# EAGLE design power_up_v2 (EAGLE 9.6.2)
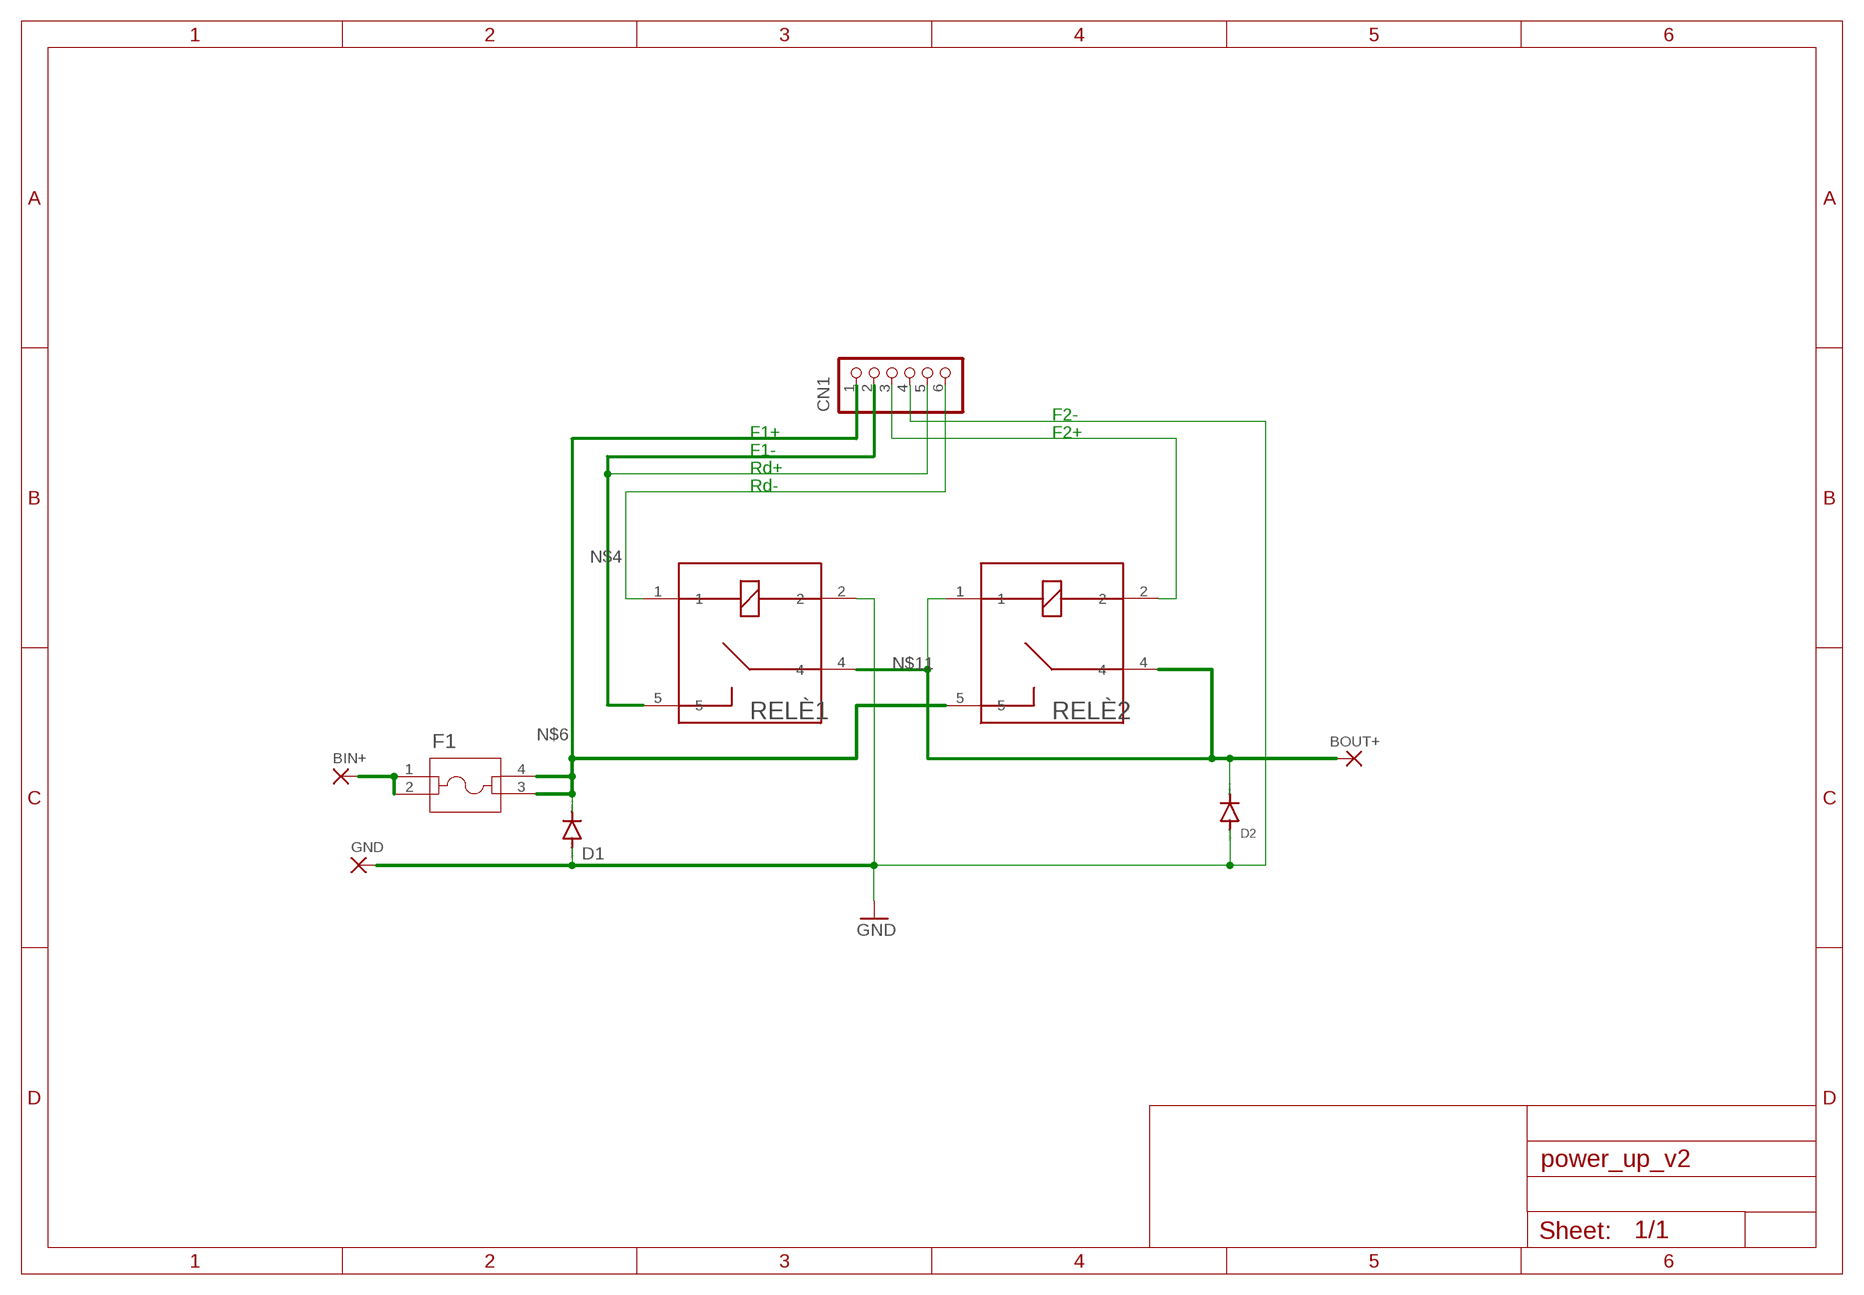
[diagram p0: schematic, sheet 1]

## Parts
BIN+  WIREPAD3,81/1,4  [12/0,7]
BOUT+  WIREPAD3,81/1,4  [12/0,7]
CN1  B6P-VH  [B6P-VH]
D1  BY550  [DO27-15]
D2  BY550  [DO27-15]
F1  3568  [3568_KEY]
GND  WIREPAD3,81/1,4  [12/0,7]
RELÈ1  1393280-5  [RELAY_1393280-5]
RELÈ2  1393280-5  [RELAY_1393280-5]

## Nets
GND: CN1.4 D1.A D2.A GND.1(P) RELÈ1.2
N$2: BIN+.1(P) F1.1 F1.2
N$4: CN1.2 CN1.5 RELÈ1.5
N$5: CN1.3 RELÈ2.2
N$6: CN1.1 D1.C F1.3 F1.4 RELÈ2.5
N$9: CN1.6 RELÈ1.1
N$11: BOUT+.1(P) D2.C RELÈ1.4 RELÈ2.1 RELÈ2.4

## Notes on the sheet
- F2-
- F1+ | F2+
- F1-
- Rd+
- Rd-

## Library data of the parts
BIN+ BOUT+ GND = wirepad:WIREPAD: Wire PAD connect wire on PCB
CN1 = jst-vh:B6P-VH: Wire-to-Board 3.96mm pitch top mount connector Source: http://www.jst-mfg.com/product/pdf/jpn/VH.pdf http://www.jst-mfg.com/product/detail.php?series=262
D1 D2 = diode:BY550: DIODE Si200 V, 5 A
F1 = 3568:3568; COPYRIGHT: Copyright (C) 2024 Ultra Librarian. All rights reserved.; MANUFACTURER_PART_NUMBER: 3568; MFR_NAME: Keystone Electronics
RELÈ1 RELÈ2 = 1393280-5:1393280-5; MANUFACTURER: TE Connectivity; MAXIMUM_PACKAGE_HEIGHT: 1.1 mm; PARTREV: 2102; STANDARD: Manufacturer Recommendations

## Board
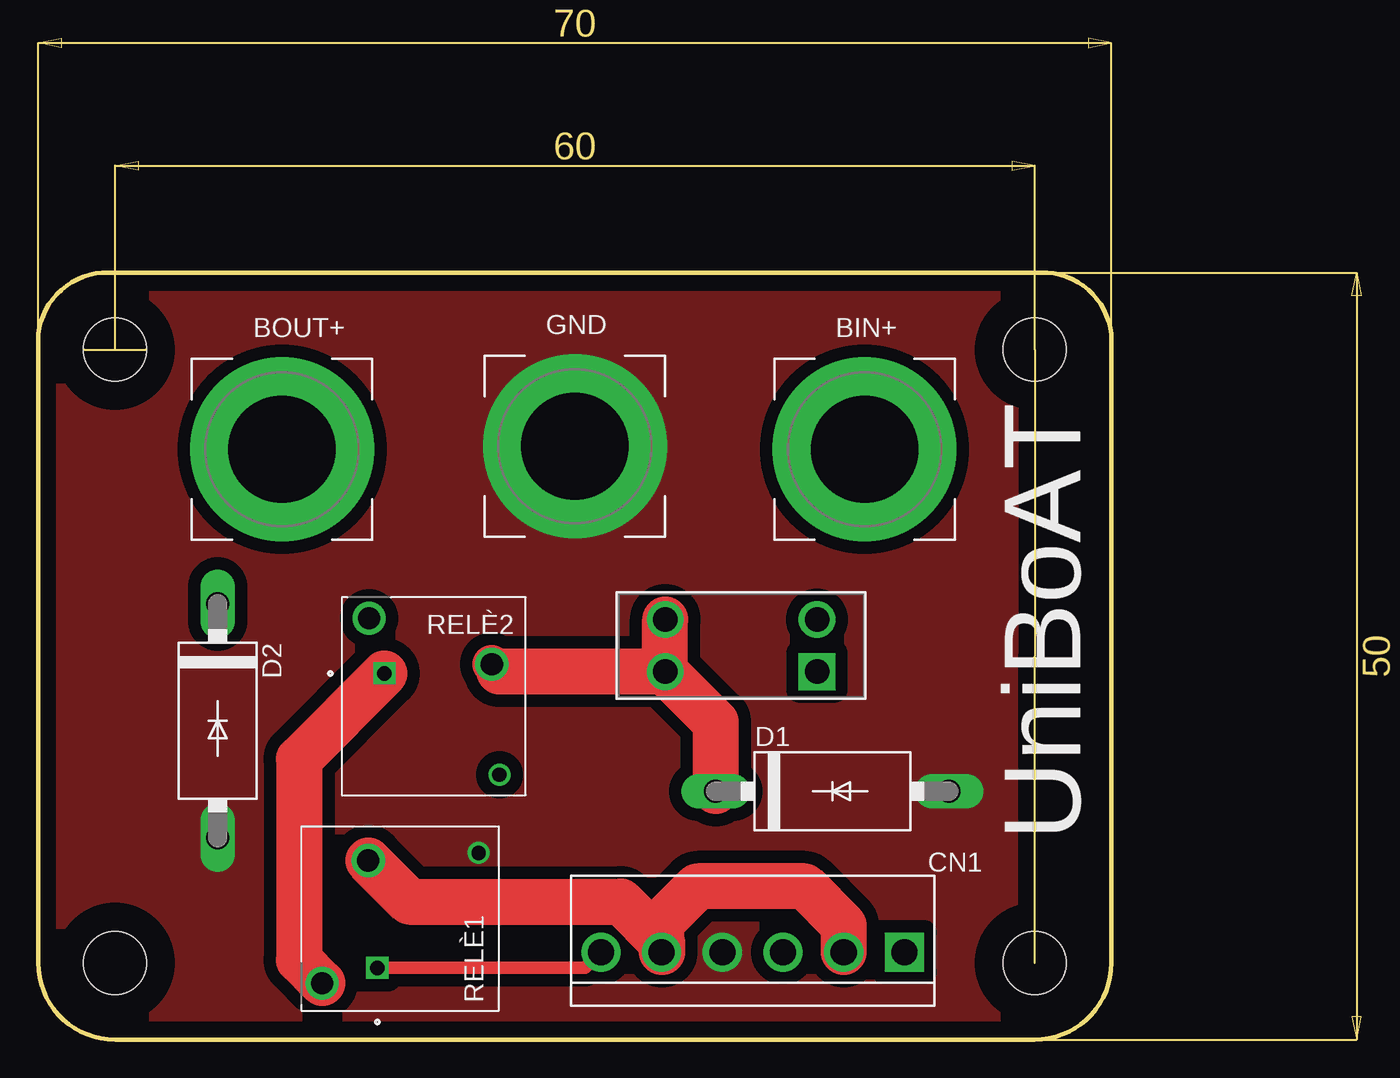
[diagram p1: board, top side]
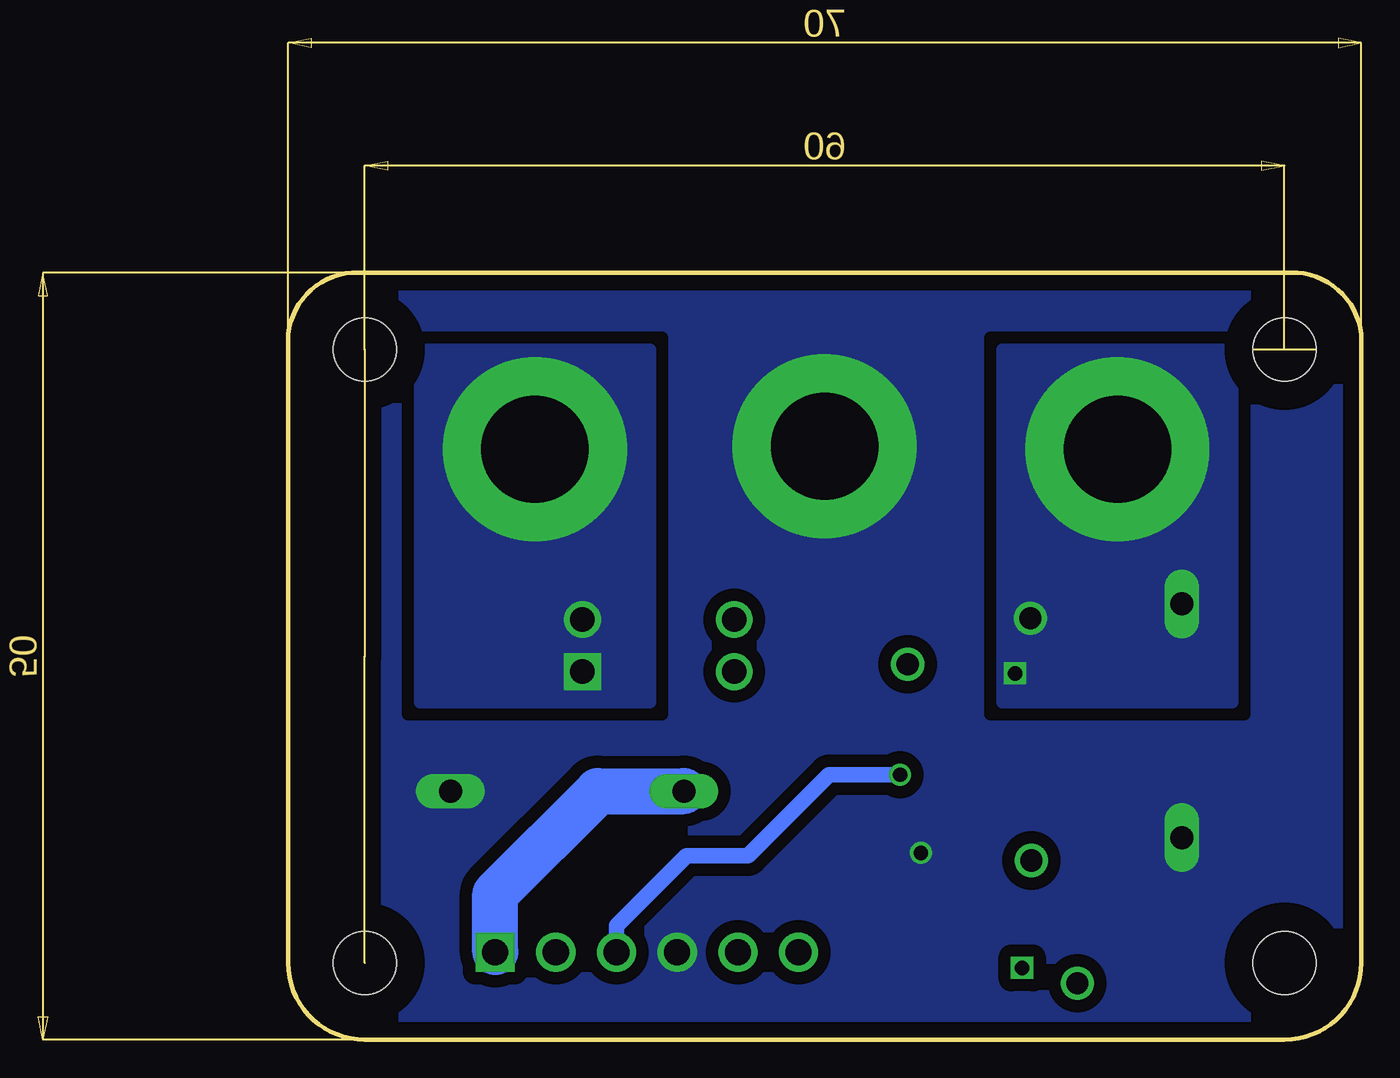
[diagram p2: board, bottom side, seen from below]

Size 70 x 50.03 mm. Coordinates in mm from the lower left corner, seen from the top.
Outline: 0,5 0,46 arc-90 5,50 65,50 arc-90 70,46 70,5 arc-90 65,0 5,0 arc-90 0,5
Copper layers (1*16): Top 0.035mm / dielectric 1.5mm / Bottom 0.035mm
Design rules "default *": minimum track width 6mil, minimum drill 0.35mm, track to track 8mil, track to pad 6mil, pad to pad 6mil, via to via 6mil, smd to smd 6mil, copper to edge 40mil, drill to drill 6mil, minimum pad ring 10mil, minimum via ring 8mil, stop-mask expansion 4mil, vias tented up to drill 0mil, thermal gap 10mil

### Footprints (pad centres in the part's own frame; a part is rotated, then mirrored left to right if it is on the bottom)
12/0,7 = drill 7 pad 12: 1 0,0
B6P-VH = drill 1.7 square: 1 -9.9,0 | drill 1.7: 2 -5.94,0; 3 -1.98,0; 4 1.98,0; 5 5.94,0; 6 9.9,0
DO27-15 = drill 1.499 long: A 7.62,0; C -7.62,0
3568_KEY = drill 1.6 pad 2.108 square: 1 0,0 | drill 1.6 pad 2.108: 2 0,-3.404; 3 9.906,-3.404; 4 9.906,0
RELAY_1393280-5 = drill 0.93 square: 1 3.22,-1.48 | drill 0.93: 2 -4.28,5.12 | drill 1.45: 4 4.22,-5.08; 5 -3.78,-2.08
M4_HOLE = hole 4.1: 0,0

### Placement (x,y rotation side)
BIN+  53.9,38.5 0 top
BOUT+  15.9,38.5 0 top
CN1  46.6,5.7 180 top
D1  51.8,16.2 0 top
D2  11.7,20.8 270 top
F1  50.8,24 180 top
GND  35,38.7 0 top
RELÈ1  23.6,7.9 270 top
RELÈ2  25.8,22.4 180 top
U$1  [M4_HOLE]  5,5 0 top
U$2  [M4_HOLE]  5,45 0 top
U$3  [M4_HOLE]  65,45 0 top
U$4  [M4_HOLE]  65,5 0 top

### Tracks (layer width: path | path; a pad name or v marks a point on that pad's centre or on a via)
GND
  pour Top (isolate 0.813, rank 6, no thermals): -8,78 -8,-6 124,-6 124,78
  pour Bottom (isolate 0.813, rank 6, no thermals): -11,80.5 -11,-9 126.5,-9 126.5,80.5
N$2
  pour Bottom (isolate 0.813, rank 2, no thermals): 46.4,45 61.4,45 61.4,22 46.4,22
N$4
  Top 3: RELÈ1.5 24.2,9 38,9 40.7,6.3 40.7,5.7 CN1.5 40.66,7.66 43,10 50,10 52.54,7.46 CN1.2
N$5
  Bottom 1: RELÈ2.2 34.72,17.28 40,12 44,12 48.58,7.42 CN1.3
N$6
  Top 2.5: 30.06,24 RELÈ2.5
  Top 3: F1.4 44.18,20.71 D1.C | F1.4 F1.3 | F1.4 30.06,24
  Bottom 3: CN1.1 56.5,9.5 49.8,16.2 D1.C
N$9
  Top 0.813: RELÈ1.1 35.68,4.68 CN1.6
N$11
  Top 3: RELÈ2.1 17,18.3 17,5.2 RELÈ1.4
  pour Bottom (isolate 0.813, rank 2, no thermals): 23.4,22 8.4,22 8.4,45 23.4,45

### Text on the board
tPlace: UniBoAT